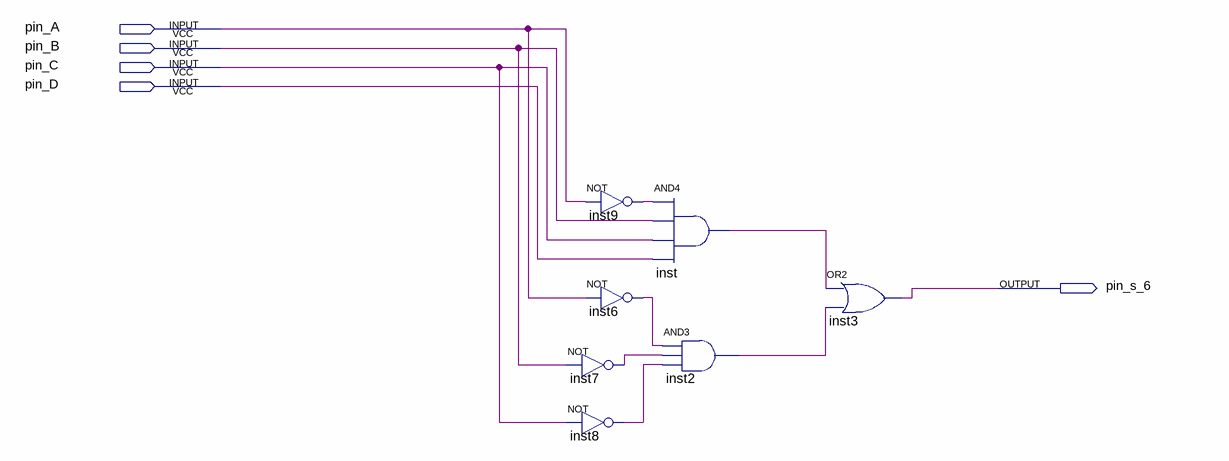
[diagram p0: schematic sheet]
// Quartus schematic s_6.bdf as structural Verilog: 7 symbols, 5 pins
module s_6 (
  input  pin_A,
  input  pin_B,
  input  pin_C,
  input  pin_D,
  output pin_s_6
);

  wire inst2_out, inst6_out, inst7_out, inst8_out, inst9_out, inst_out;

  not inst7 (inst7_out, pin_B);
  not inst8 (inst8_out, pin_C);
  and inst (inst_out, inst9_out, pin_B, pin_C, pin_D);
  not inst9 (inst9_out, pin_A);
  not inst6 (inst6_out, pin_A);
  and inst2 (inst2_out, inst6_out, inst7_out, inst8_out);
  or inst3 (pin_s_6, inst_out, inst2_out);
endmodule
